# Altium schematic sheet Peripherals.SchDoc: Wacky Hat Peripherals
size A3; Author: JDU & EWI; DrawnBy: JDU & EWI; Organization: Group 33; Address1: ECE Department; Address2: University of Canterbury; Address3: Christchurch 8041; Address4: New Zealand; DocumentNumber: 003; Revision: 1; SheetNumber: 3; SheetTotal: 3; ImagePath: \\maxwell\elecapp\AltiumDesigner\Templates\uc-logo.png
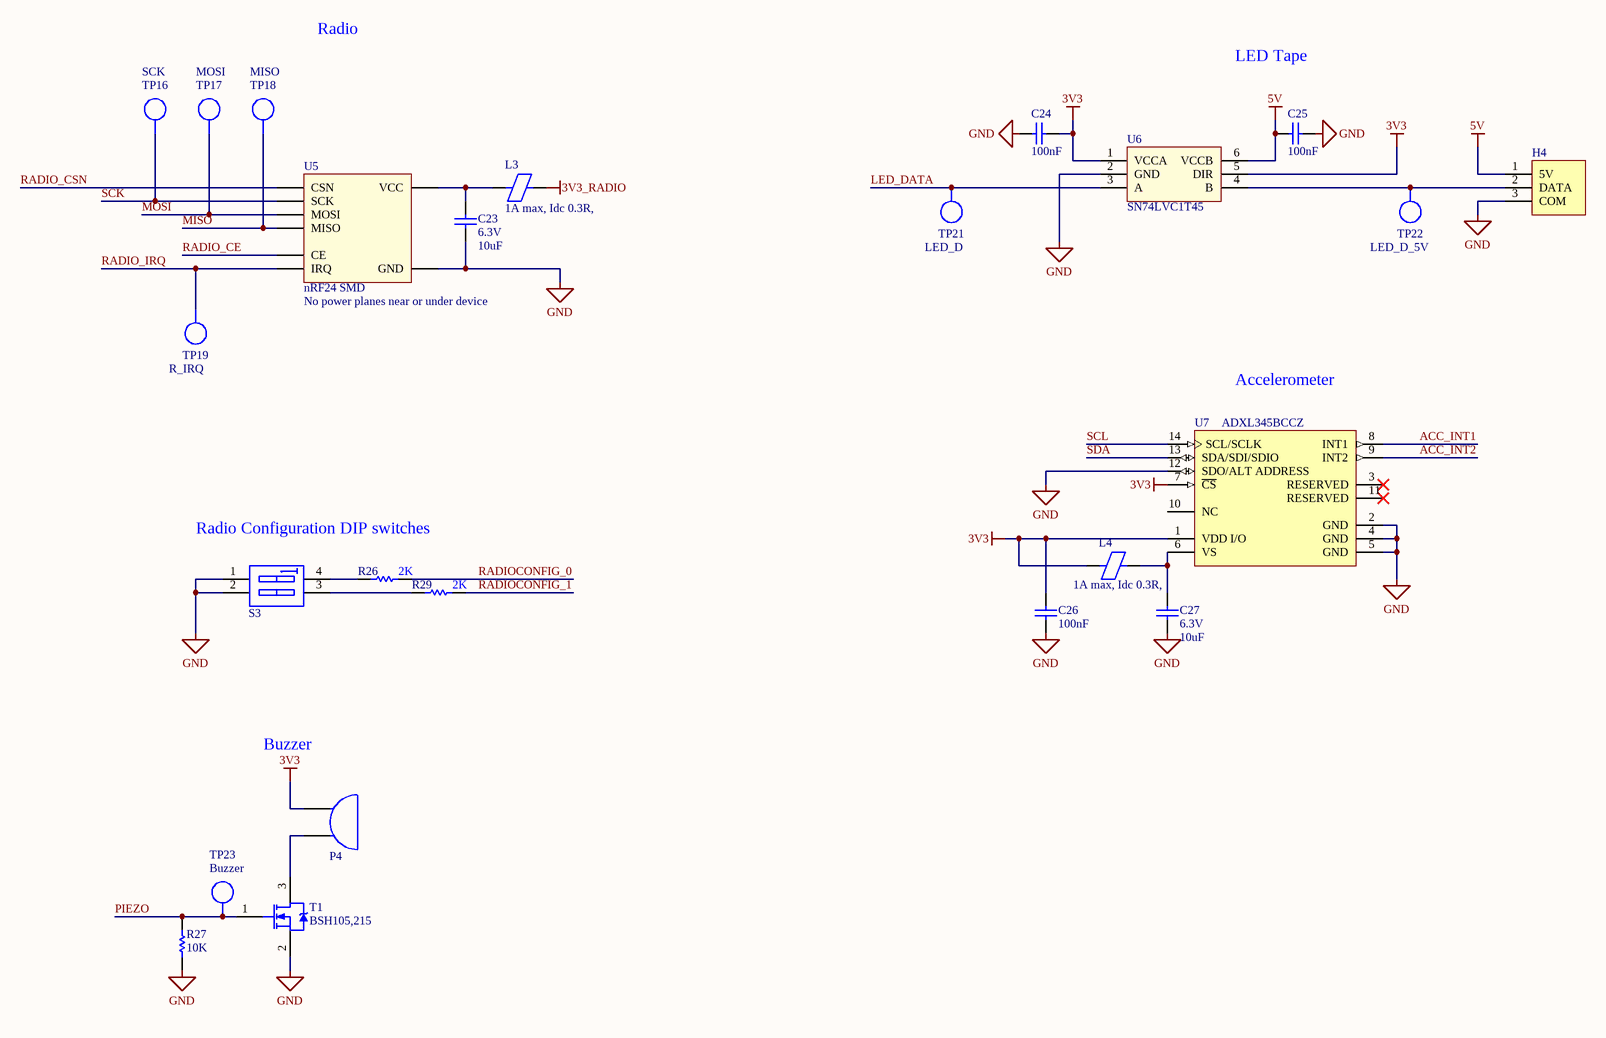
[diagram p0: Peripherals.SchDoc]

## Parts
C23  Voltage - Rated: 6.3V  [CAPC1608L]  (hidden comment: 10uF)
C24  100nF  [CAPC1608L]
C25  100nF  [CAPC1608L]
C26  100nF  [CAPC1608L]
C27  Voltage - Rated: 6.3V  [CAPC1608L]  (hidden comment: 10uF)
H4  3 Pin Molex KK Hdr  [MOLEX_KK_3_HDR]  (value not drawn)
L3  1A max, Idc 0.3R,  [INDC3216L]
L4  1A max, Idc 0.3R,  [INDC3216L]
P4  Piezo Buzzer  [BUZZER]  (value not drawn)
R26  2K  [RESC1608L]
R27  10K  [RESC1608L]
R29  2K  [RESC1608L]
S3  WS_SW DIP-2  [DIP_SW_2WAY_SMD]  (value not drawn)
T1  BSH105,215  [SOT23_L]
TP16  SCK  [TP_1206]  (no BOM)
TP17  MOSI  [TP_1206]  (no BOM)
TP18  MISO  [TP_1206]  (no BOM)
TP19  R_IRQ  [TP_1206]  (no BOM)
TP21  LED_D  [TP_1206]  (no BOM)
TP22  LED_D_5V  [TP_1206]  (no BOM)
TP23  Buzzer  [TP_1206]  (no BOM)
U5  nRF24 SMD  Warning: No power planes near or under device  [NRF24]
U6  SN74LVC1T45  [SOT23-6_N]
U7  ADXL345BCCZ  [ADI-CC-14-1_V]

## Nets
3V3: C24.2 C26.2 L4.2 P4.1 U6.1(VCCA) U6.5(DIR) U7.1(VDD_I/O) U7.7(~{CS})
3V3_RADIO: L3.2
5V: C25.2 H4.1(5V) U6.6(VCCB)
GND: C23.1 C24.1 C25.1 C26.1 C27.1 H4.3(COM) R27.2 S3.1(A1) S3.2(A2) T1.2 U5.2(GND) U6.2(GND) U7.2(GND) U7.4(GND) U7.5(GND) U7.12(SDO/ALT_ADDRESS)
ACC_INT1: U7.8(INT1)
ACC_INT2: U7.9(INT2)
LED_DATA: TP21.1 U6.3(A)
MISO: TP18.1 U5.7(MISO)
MOSI: TP17.1 U5.6(MOSI)
PIEZO: R27.1 T1.1 TP23.1
RADIO_CE: U5.3(CE)
RADIO_CSN: U5.4(CSN)
RADIO_IRQ: TP19.1 U5.8(IRQ)
RADIOCONFIG_0: R26.2
RADIOCONFIG_1: R29.2
SCK: TP16.1 U5.5(SCK)
SCL: U7.14(SCL/SCLK)
SDA: U7.13(SDA/SDI/SDIO)
NetC23_2: C23.2 L3.1 U5.1(VCC)
NetC27_2: C27.2 L4.1 U7.6(VS)
NetH4_2: H4.2(DATA) TP22.1 U6.4(B)
NetP4_2: P4.2 T1.3
NetR26_1: R26.1 S3.4(B1)
NetR29_1: R29.1 S3.3(B2)

Not connected (* = marked no-connect by the designer): U7 3(RESERVED)* 10(NC) 11(RESERVED)*

## Notes on the sheet
- Radio
- LED Tape
- Accelerometer
- Radio Configuration DIP switches
- Buzzer
- Title
- Drawn by:
- Date:
- Time:
- Revision:
- Sheet
- of
- File:

## Library data of the parts
C23 C27 = CC_10uF_0603: CAP CER 10UF X5R +-20% 6V3 0603; Supplier: ECE Dept; Storage Location: PCB Assembly WS; Value: 10uF
C24-C26 = CC_100nF_0603: CAP CER 100nF X7R +-10% 50V 0603; PackageReference: 0603; Code_IPC: 1608 [0603]; Verify: *; Supplier: ECE Dept; Storage Location: PCB Assembly WS; Value: 100nF
H4 = LED_Strip_Header: CONN HEADER 3POS 2.54mm VERT_Thru Hole; Manufacturer: Molex; Manufacturer PN: 22-23-2031; Supplier Part Number 1: 9731156; Supplier: ECE Dept; Supplier 1: Farnell; Storage Location: ECE Dept Store; Value: 3 Pin Molex KK Hdr
L3 L4 = IN_Ferrite-Bead: Ferrite Bead, Rdc 0.3R, Z100MHZ 600R, Imax 1A, SMD 1206; Manufacturer: FAIR-RITE; Manufacturer PN: 2512066017Y1; DC Current Rating: 1; DC Resistance Max: 0.08; Ferrite Case Style: 1206 ^3216 Metric]; Frequency Range: 50MHz to 1; Impedance: 600; Impedance Tolerance: ± 25%; Supplier: ECE Dept; Storage Location: PCB Assembly WS; Ferrite Mounting: SMD; Supplier 1: Farnell; Supplier Part Number 1: 1612060; Manufacturer Part Number: 2512066017Y1; Value: 1A max, Idc 0.3R,
P4 = Piezo Buzzer: TDK - PS1240P02BT - BUZZER, PIEZO, 70DB, 12.2MM; Number of Terminals/Pins: 2; Frequency: 4kHz; Operating Supply Voltage: 3V; Washable: No; Supplier 1: Digi-Key; Manufacturer 1: TDK; Manufacturer Part Number 1: PS1240P02BT; Stock 1: 24025; Pricing 1: 1=0.61000, 10=0.52500, 25=0.49120, 50=0.46580, 100=0.44110 (USD); RoHS: Yes; Mount: Through Hole; Number of Pins: 2; Min Operating Temperature: -10°C; Max Operating Temperature: 70°C; Package Quantity: 1; Packaging: Tape and Reel; Termination: PC Pins; Voltage Rating (DC): 3V; Series: PS; Diameter: 12.2mm; Height: 6.5mm; Lead Free: Lead Free; RoHS Compliant: Yes; ComponentLink1URL: https://datasheet.ciiva.com/0/ef532-ps-112.pdf?src-supplier=Digi-Key; ComponentLink1Description: https://datasheet.ciiva.com/0/ef532-ps-112.pdf?src-supplier=Digi-Key; ComponentLink2URL: https://datasheet.ciiva.com/0/ef532-ps-111.pdf?src-supplier=Digi-Key; ComponentLink2Description: https://datasheet.ciiva.com/0/ef532-ps-111.pdf?src-supplier=Digi-Key; ComponentLink3URL: https://datasheet.ciiva.com/3306/ef532-ps-3306958.pdf?src-supplier=Avnet; ComponentLink3Description: https://datasheet.ciiva.com/3306/ef532-ps-3306958.pdf?src-supplier=Avnet; ComponentLink4URL: https://datasheet.ciiva.com/16225/ef532-ps-16225062.pdf?src-supplier=Onlinecomponents.com; ComponentLink4Description: https://datasheet.ciiva.com/16225/ef532-ps-16225062.pdf?src-supplier=Onlinecomponents.com; Supplier Part Number 1: 445-2525-1-ND
R26 R29 = RS_2K: RES 2K OHM 1/10W 5% 0603 SMD; Storage Location: PCB Assembly WS; Supplier: ECE Dept; Value: 2K
R27 = RS_10K: RES 10.0K OHM 1/10W 5% 0603 SMD; Storage Location: PCB Assembly WS; Supplier: ECE Dept; Value: 10K
S3 = WS_SW DIP-2: DIP Switch, 2 Position, SPST SMD; Manufacturer: OMRON ELECTRONIC COMPONENTS; Manufacturer Part Number: A6SN-2101; Contact Current DC Max: 25; External Length / Height: 7; No. of Switch Positions: 2; Pitch Spacing: 2.54; PackageReference: DIP-4; Contact Configuration: SPST; Supplier 1: Farnell; Supplier Part Number 1: 2029424; Storage Location: PCB Assembly WS; Supplier: ECE Dept
T1 = TM_BSH105: MOSFET N-CH 20V 1.05A SOT-23; Manufacturer: NXP Semiconductors; FET Type: MOSFET N-Channel, Metal Oxide; Gate Charge (Qg) @ Vgs: 3.9nC @ 4.5V; Input Capacitance (Ciss) @ Vds: 152pF @ 16V; Power - Max: 417mW; Rds On (Max) @ Id, Vgs: 200 mOhm @ 600mA, 4.5V; Supplier 1: Farnell; Supplier 2: Digi-Key; Current - Continuous Drain (Id) @ 25° C: 1.05A; Drain to Source Voltage (Vdss): 20V; Package / Case: TO-236-3, SC-59, SOT-23-3; Pricing: 1=0.53, 10=0.42, 25=0.3544, 100=0.2885, 250=0.23896, 500=0.1974, 1000=0.14785 (NZD); Supplier Part Number 1: 1758066; Supplier Part Number 2: 568-6215-1-ND; Storage Location: PCB Assembly WS; Supplier: ECE Dept; Manufacturer Part Number: BSH105,215
TP16-TP19 TP21-TP23 = TP_1206: Test-Point 3.3x1.6x2.1mm SMD; Manufacturer: Harwin Inc; Manufacturer Part Number: S1751-46R; Value: TP; Manufacturer PN: *; Storage Location: ProtoPlace; Mounting Type: Surface Mount; Type: PC Test Point; Supplier 1: Digi-Key; Supplier Part Number 1: 952-1478-2-ND; Supplier 2: Farnell; Supplier Part Number 2: 1826282; Supplier: ECE Dept
U5 = NRF24: nRF24 SMD Module
U6 = SN74LVC1T45: 1.8V - 5V level converter
U7 = ADXL345BCCZ: Accelerometer 3-Axis, +/-2 g / +/-4 g / +/-8 g / +/-16 g with Digital Output, 1.6 KHz BW, Industrial, 14-pin LGA, Tray; Manufacturer: Analog Devices; Sensitivity: 256/128/64/32 LSB/g; Voltage Supply (V): 2.0 to 3.6; Supply Current: 140 uA; # of Axes: 3; -3dB Bandwidth: 1.6 KHz; PackageReference: CC-14-1; ComponentLink1Description: Manufacturer URL; Packing: Tray; ComponentLink4URL: http://www.analog.com/en/mems-sensors/mems-inertial-sensors/adxl345/products/product.html; ComponentLink2URL: http://www.analog.com/static/imported-files/data_sheets/ADXL345.pdf; Mounting Technology: Surface Mount; ComponentLink3URL: http://www.analog.com/static/imported-files/data_sheets/ADXL343.pdf; PartNumber: ADXL345BCCZ; ComponentLink4Description: Product URL; Output Type: Digital; ComponentLink3Description: Package Specification; DatasheetVersion: Rev. D; PackageVersion: 03-16-2010-A, 03/2010; ComponentLink1URL: http://www.analog.com/en/index.html; ComponentLink2Description: Datasheet; PackageDescription: 14-Pin Land Grid Array, 3 x 5 mm Body, 0.8 mm Pitch; Manufacturer 1: Analog Devices; Manufacturer Part Number 1: ADXL345BCCZ